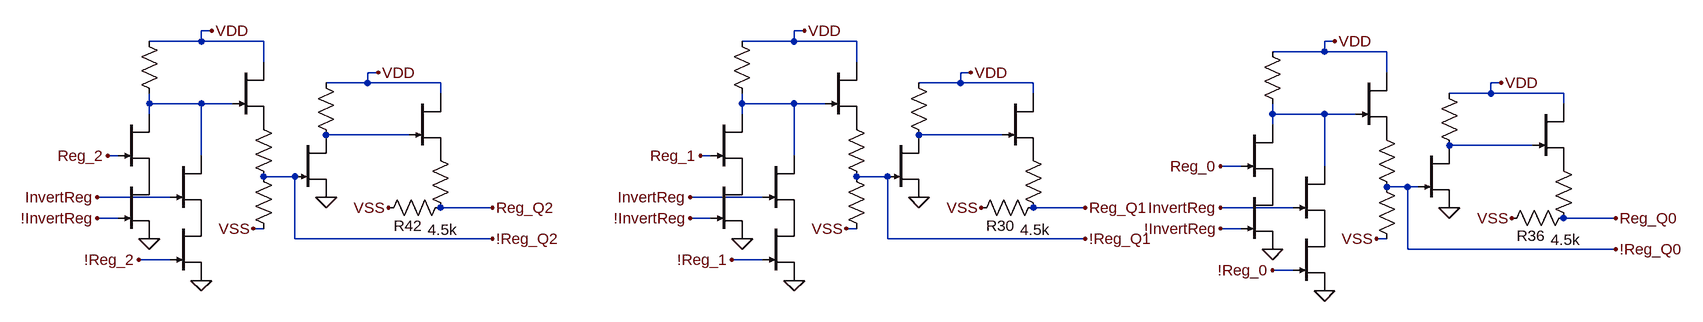
[diagram p0: schematic XORS 3 bits.asc]
XORS 3 bits.asc, the LTspice schematic file:
Version 4.1
SHEET 1 109444 42780
WIRE -5360 -16 -5376 -16
WIRE -4448 -16 -4464 -16
WIRE -5376 0 -5376 -16
WIRE -5376 0 -5456 0
WIRE -5280 0 -5376 0
WIRE -4464 0 -4464 -16
WIRE -4464 0 -4544 0
WIRE -4368 0 -4464 0
WIRE -3632 0 -3648 0
WIRE -3648 16 -3648 0
WIRE -3648 16 -3728 16
WIRE -3552 16 -3648 16
WIRE -5280 32 -5280 0
WIRE -4368 32 -4368 0
WIRE -5104 48 -5120 48
WIRE -4192 48 -4208 48
WIRE -3552 48 -3552 16
WIRE -5120 64 -5120 48
WIRE -5120 64 -5184 64
WIRE -5008 64 -5120 64
WIRE -4208 64 -4208 48
WIRE -4208 64 -4272 64
WIRE -4096 64 -4208 64
WIRE -3376 64 -3392 64
WIRE -5008 80 -5008 64
WIRE -4096 80 -4096 64
WIRE -3392 80 -3392 64
WIRE -3392 80 -3456 80
WIRE -3280 80 -3392 80
WIRE -5456 96 -5456 80
WIRE -5376 96 -5456 96
WIRE -5328 96 -5376 96
WIRE -4544 96 -4544 80
WIRE -4464 96 -4544 96
WIRE -4416 96 -4464 96
WIRE -3280 96 -3280 80
WIRE -5456 112 -5456 96
WIRE -4544 112 -4544 96
WIRE -3728 112 -3728 96
WIRE -3648 112 -3728 112
WIRE -3600 112 -3648 112
WIRE -3728 128 -3728 112
WIRE -5056 144 -5184 144
WIRE -4144 144 -4272 144
WIRE -3328 160 -3456 160
WIRE -5504 176 -5520 176
WIRE -5376 176 -5376 96
WIRE -4592 176 -4608 176
WIRE -4464 176 -4464 96
WIRE -3776 192 -3808 192
WIRE -3648 192 -3648 112
WIRE -5232 208 -5280 208
WIRE -4320 208 -4368 208
WIRE -3520 224 -3552 224
WIRE -3504 224 -3520 224
WIRE -5424 240 -5536 240
WIRE -4512 240 -4624 240
WIRE -4928 256 -5008 256
WIRE -4016 256 -4096 256
WIRE -3696 256 -3808 256
WIRE -5504 272 -5536 272
WIRE -4592 272 -4624 272
WIRE -3200 272 -3280 272
WIRE -5280 288 -5296 288
WIRE -4368 288 -4384 288
WIRE -3776 288 -3808 288
WIRE -5232 304 -5232 208
WIRE -4928 304 -5232 304
WIRE -4320 304 -4320 208
WIRE -4016 304 -4320 304
WIRE -3552 304 -3568 304
WIRE -3520 320 -3520 224
WIRE -3200 320 -3520 320
WIRE -5424 336 -5472 336
WIRE -4512 336 -4560 336
WIRE -3696 352 -3728 352
FLAG -4464 368 0
FLAG -4544 304 0
FLAG -4272 240 0
FLAG -4448 -16 VDD
FLAG -4192 48 VDD
FLAG -4384 288 VSS
FLAG -4176 256 VSS
FLAG -4624 240 InvertReg
FLAG -3648 384 0
FLAG -3728 320 0
FLAG -3456 256 0
FLAG -3632 0 VDD
FLAG -3376 64 VDD
FLAG -3568 304 VSS
FLAG -3360 272 VSS
FLAG -3808 288 !InvertReg
FLAG -4608 176 Reg_1
FLAG -4016 256 Reg_Q1
FLAG -3200 272 Reg_Q0
FLAG -3200 320 !Reg_Q0
FLAG -4016 304 !Reg_Q1
FLAG -4560 336 !Reg_1
FLAG -3808 192 Reg_0
FLAG -3728 352 !Reg_0
FLAG -3808 256 InvertReg
FLAG -4624 272 !InvertReg
FLAG -5376 368 0
FLAG -5456 304 0
FLAG -5184 240 0
FLAG -5360 -16 VDD
FLAG -5104 48 VDD
FLAG -5296 288 VSS
FLAG -5088 256 VSS
FLAG -5536 240 InvertReg
FLAG -5520 176 Reg_2
FLAG -4928 256 Reg_Q2
FLAG -4928 304 !Reg_Q2
FLAG -5472 336 !Reg_2
FLAG -5536 272 !InvertReg
SYMBOL njf -4592 112 R0
WINDOW 0 56 32 Invisible 2
WINDOW 3 56 72 Invisible 2
SYMATTR InstName J_A19
SYMATTR Value DR
SYMBOL res -4560 -16 R0
WINDOW 0 -35 57 Invisible 2
WINDOW 3 34 56 Invisible 2
SYMATTR InstName R25
SYMATTR Value 100k
SYMBOL njf -4416 32 R0
WINDOW 0 56 32 Invisible 2
WINDOW 3 56 72 Invisible 2
SYMATTR InstName J_F7
SYMATTR Value DR
SYMBOL res -4384 112 R0
WINDOW 0 -24 60 Invisible 2
WINDOW 3 34 58 Invisible 2
SYMATTR InstName R26
SYMATTR Value 1k
SYMBOL res -4384 192 R0
WINDOW 0 -31 62 Invisible 2
WINDOW 3 37 62 Invisible 2
SYMATTR InstName R27
SYMATTR Value 4.8k
SYMBOL njf -4512 176 R0
WINDOW 0 56 32 Invisible 2
WINDOW 3 56 72 Invisible 2
SYMATTR InstName J_B9
SYMATTR Value DR
SYMBOL njf -4320 144 R0
WINDOW 0 56 32 Invisible 2
WINDOW 3 56 72 Invisible 2
SYMATTR InstName J_A20
SYMATTR Value DR
SYMBOL res -4288 48 R0
WINDOW 0 56 32 Invisible 2
WINDOW 3 56 72 Invisible 2
SYMATTR InstName R28
SYMATTR Value 50k
SYMBOL njf -4144 80 R0
WINDOW 0 56 32 Invisible 2
WINDOW 3 56 72 Invisible 2
SYMATTR InstName J_A25
SYMATTR Value DR
SYMBOL res -4112 160 R0
WINDOW 0 37 24 Invisible 2
WINDOW 3 -30 25 Invisible 2
SYMATTR InstName R29
SYMATTR Value 1k
SYMBOL res -4080 240 R90
WINDOW 0 59 66 VBottom 2
WINDOW 3 34 13 VTop 2
SYMATTR InstName R30
SYMATTR Value 4.5k
SYMBOL njf -4592 208 R0
WINDOW 0 57 49 Invisible 2
WINDOW 3 56 72 Invisible 2
SYMATTR InstName J_A26
SYMATTR Value DR
SYMBOL njf -4512 272 R0
WINDOW 0 56 32 Invisible 2
WINDOW 3 56 72 Invisible 2
SYMATTR InstName J_B10
SYMATTR Value DR
SYMBOL njf -3776 128 R0
WINDOW 0 56 32 Invisible 2
WINDOW 3 56 72 Invisible 2
SYMATTR InstName J_A27
SYMATTR Value DR
SYMBOL res -3744 0 R0
WINDOW 0 -35 57 Invisible 2
WINDOW 3 34 56 Invisible 2
SYMATTR InstName R31
SYMATTR Value 100k
SYMBOL njf -3600 48 R0
WINDOW 0 56 32 Invisible 2
WINDOW 3 56 72 Invisible 2
SYMATTR InstName J_F8
SYMATTR Value DR
SYMBOL res -3568 128 R0
WINDOW 0 -24 60 Invisible 2
WINDOW 3 34 58 Invisible 2
SYMATTR InstName R32
SYMATTR Value 1k
SYMBOL res -3568 208 R0
WINDOW 0 -31 62 Invisible 2
WINDOW 3 37 62 Invisible 2
SYMATTR InstName R33
SYMATTR Value 4.8k
SYMBOL njf -3696 192 R0
WINDOW 0 56 32 Invisible 2
WINDOW 3 56 72 Invisible 2
SYMATTR InstName J_B11
SYMATTR Value DR
SYMBOL njf -3504 160 R0
WINDOW 0 56 32 Invisible 2
WINDOW 3 56 72 Invisible 2
SYMATTR InstName J_A28
SYMATTR Value DR
SYMBOL res -3472 64 R0
WINDOW 0 56 32 Invisible 2
WINDOW 3 56 72 Invisible 2
SYMATTR InstName R34
SYMATTR Value 50k
SYMBOL njf -3328 96 R0
WINDOW 0 56 32 Invisible 2
WINDOW 3 56 72 Invisible 2
SYMATTR InstName J_A29
SYMATTR Value DR
SYMBOL res -3296 176 R0
WINDOW 0 37 24 Invisible 2
WINDOW 3 -30 25 Invisible 2
SYMATTR InstName R35
SYMATTR Value 1k
SYMBOL res -3264 256 R90
WINDOW 0 59 66 VBottom 2
WINDOW 3 34 13 VTop 2
SYMATTR InstName R36
SYMATTR Value 4.5k
SYMBOL njf -3776 224 R0
WINDOW 0 57 49 Invisible 2
WINDOW 3 56 72 Invisible 2
SYMATTR InstName J_A30
SYMATTR Value DR
SYMBOL njf -3696 288 R0
WINDOW 0 56 32 Invisible 2
WINDOW 3 56 72 Invisible 2
SYMATTR InstName J_B12
SYMATTR Value DR
SYMBOL njf -5504 112 R0
WINDOW 0 56 32 Invisible 2
WINDOW 3 56 72 Invisible 2
SYMATTR InstName J_A31
SYMATTR Value DR
SYMBOL res -5472 -16 R0
WINDOW 0 -35 57 Invisible 2
WINDOW 3 34 56 Invisible 2
SYMATTR InstName R37
SYMATTR Value 100k
SYMBOL njf -5328 32 R0
WINDOW 0 56 32 Invisible 2
WINDOW 3 56 72 Invisible 2
SYMATTR InstName J_F9
SYMATTR Value DR
SYMBOL res -5296 112 R0
WINDOW 0 -24 60 Invisible 2
WINDOW 3 34 58 Invisible 2
SYMATTR InstName R38
SYMATTR Value 1k
SYMBOL res -5296 192 R0
WINDOW 0 -31 62 Invisible 2
WINDOW 3 37 62 Invisible 2
SYMATTR InstName R39
SYMATTR Value 4.8k
SYMBOL njf -5424 176 R0
WINDOW 0 56 32 Invisible 2
WINDOW 3 56 72 Invisible 2
SYMATTR InstName J_B13
SYMATTR Value DR
SYMBOL njf -5232 144 R0
WINDOW 0 56 32 Invisible 2
WINDOW 3 56 72 Invisible 2
SYMATTR InstName J_A32
SYMATTR Value DR
SYMBOL res -5200 48 R0
WINDOW 0 56 32 Invisible 2
WINDOW 3 56 72 Invisible 2
SYMATTR InstName R40
SYMATTR Value 50k
SYMBOL njf -5056 80 R0
WINDOW 0 56 32 Invisible 2
WINDOW 3 56 72 Invisible 2
SYMATTR InstName J_A33
SYMATTR Value DR
SYMBOL res -5024 160 R0
WINDOW 0 37 24 Invisible 2
WINDOW 3 -30 25 Invisible 2
SYMATTR InstName R41
SYMATTR Value 1k
SYMBOL res -4992 240 R90
WINDOW 0 59 66 VBottom 2
WINDOW 3 34 13 VTop 2
SYMATTR InstName R42
SYMATTR Value 4.5k
SYMBOL njf -5504 208 R0
WINDOW 0 57 49 Invisible 2
WINDOW 3 56 72 Invisible 2
SYMATTR InstName J_A34
SYMATTR Value DR
SYMBOL njf -5424 272 R0
WINDOW 0 56 32 Invisible 2
WINDOW 3 56 72 Invisible 2
SYMATTR InstName J_B14
SYMATTR Value DR

The netlist it stands for:
* XORS 3 bits.asc
J_A19 N002 Reg_1 P001 DR
R25 VDD N002 100k
J_F7 VDD N002 P002 DR
R26 P002 !Reg_Q1 1k
R27 !Reg_Q1 VSS 4.8k
J_B9 N002 InvertReg P003 DR
J_A20 N005 !Reg_Q1 0 DR
R28 VDD N005 50k
J_A25 VDD N005 P004 DR
R29 P004 Reg_Q1 1k
R30 Reg_Q1 VSS 4.5k
J_A26 P001 !InvertReg 0 DR
J_B10 P003 !Reg_1 0 DR
J_A27 N003 Reg_0 P005 DR
R31 VDD N003 100k
J_F8 VDD N003 P006 DR
R32 P006 !Reg_Q0 1k
R33 !Reg_Q0 VSS 4.8k
J_B11 N003 InvertReg P007 DR
J_A28 N006 !Reg_Q0 0 DR
R34 VDD N006 50k
J_A29 VDD N006 P008 DR
R35 P008 Reg_Q0 1k
R36 Reg_Q0 VSS 4.5k
J_A30 P005 !InvertReg 0 DR
J_B12 P007 !Reg_0 0 DR
J_A31 N001 Reg_2 P009 DR
R37 VDD N001 100k
J_F9 VDD N001 P010 DR
R38 P010 !Reg_Q2 1k
R39 !Reg_Q2 VSS 4.8k
J_B13 N001 InvertReg P011 DR
J_A32 N004 !Reg_Q2 0 DR
R40 VDD N004 50k
J_A33 VDD N004 P012 DR
R41 P012 Reg_Q2 1k
R42 Reg_Q2 VSS 4.5k
J_A34 P009 !InvertReg 0 DR
J_B14 P011 !Reg_2 0 DR
.model NJF NJF
.model PJF PJF
.lib standard.jft
.backanno
.end